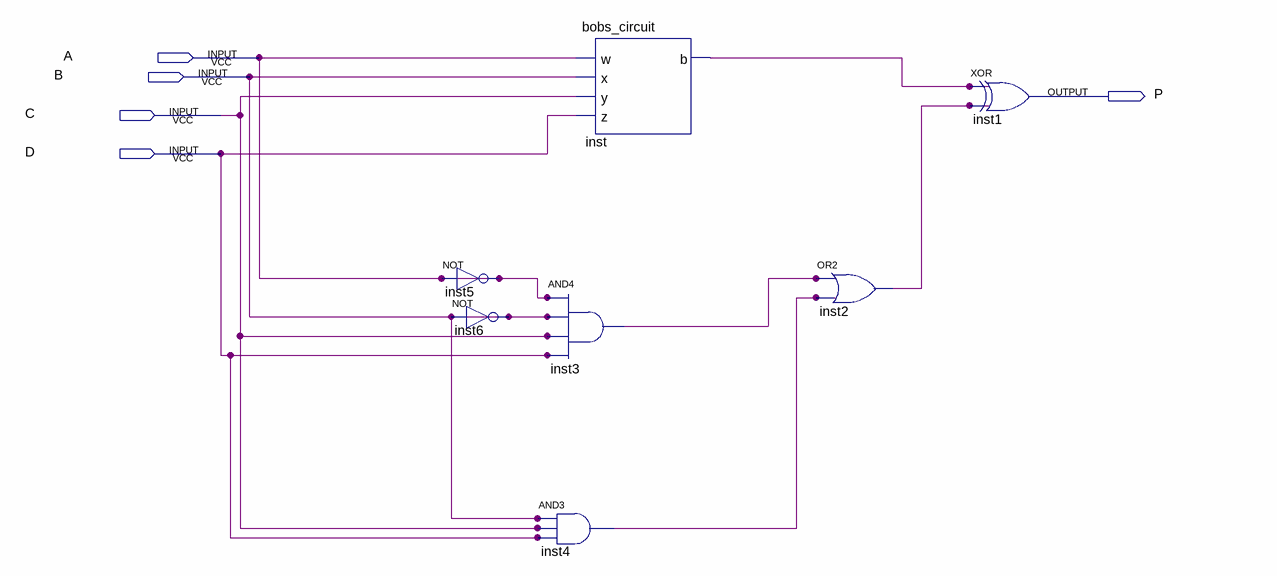
[diagram p0: schematic sheet]
// Quartus schematic mProjCircuit.bdf as structural Verilog: 7 symbols, 5 pins
module mProjCircuit (
  input  A,
  input  B,
  input  C,
  input  D,
  output P
);

  wire inst2_out, inst3_out, inst4_out, inst_b;

  not inst5 (A, A);
  not inst6 (B, B);
  and inst3 (inst3_out, A, B, C, D);
  and inst4 (inst4_out, B, C, D);
  bobs_circuit inst (.w(A), .x(B), .y(C), .z(D), .b(inst_b));
  or inst2 (inst2_out, inst3_out, inst4_out);
  xor inst1 (P, inst_b, inst2_out);
endmodule
